# Altium schematic sheet DAC.SchDoc
size A
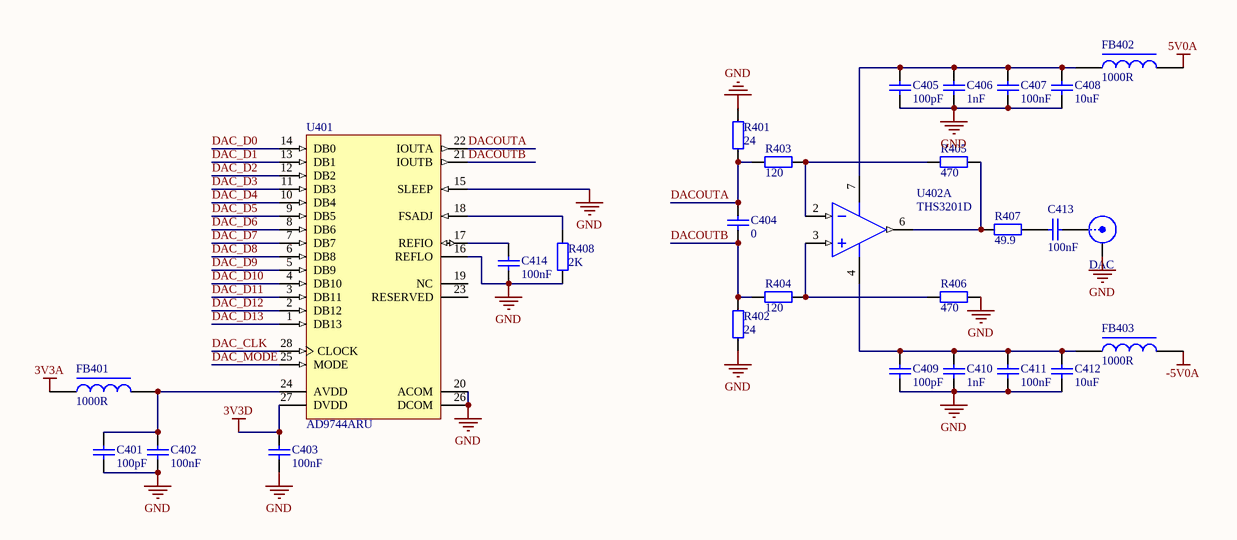
[diagram p0: DAC.SchDoc]

## Parts
C401  value 100pF  [0402C]  (hidden comment: MLCC)
C402  value 100nF  [0402C]  (hidden comment: MLCC)
C403  value 100nF  [0402C]  (hidden comment: MLCC)
C404  value 0  [0603C]  (hidden comment: MLCC)
C405  value 100pF  [0402C]  (hidden comment: MLCC)
C406  value 1nF  [0402C]  (hidden comment: MLCC)
C407  value 100nF  [0603C]  (hidden comment: MLCC)
C408  value 10uF  [0805C]  (hidden comment: MLCC)
C409  value 100pF  [0402C]  (hidden comment: MLCC)
C410  value 1nF  [0402C]  (hidden comment: MLCC)
C411  value 100nF  [0603C]  (hidden comment: MLCC)
C412  value 10uF  [0805C]  (hidden comment: MLCC)
C413  value 100nF  [0603C]  (hidden comment: MLCC)
C414  value 100nF  [0402C]  (hidden comment: MLCC)
DAC  SMA  [SMA-V]  (value not drawn)
FB401  value 1000R  [0603L]  (hidden comment: FerriteBead)
FB402  value 1000R  [0603L]  (hidden comment: FerriteBead)
FB403  value 1000R  [0603L]  (hidden comment: FerriteBead)
R401  value 24  [0603R]  (hidden comment: Resistor)
R402  value 24  [0603R]  (hidden comment: Resistor)
R403  value 120  [0603R]  (hidden comment: Resistor)
R404  value 120  [0603R]  (hidden comment: Resistor)
R405  value 470  [0603R]  (hidden comment: Resistor)
R406  value 470  [0603R]  (hidden comment: Resistor)
R407  value 49.9  [0603R]  (hidden comment: Resistor)
R408  value 2K  [0603R]  (hidden comment: Resistor)
U401  AD9744ARU  [RU-28_N]
U402  THS3201D  [D0008A_N]  (part A of 2)

## Nets
3V3A: FB401.1
3V3D: C403.2 U401.27(DVDD)
5V0A: FB402.2
-5V0A: FB403.2
GND: C401.1 C402.1 C403.1 C405.1 C406.1 C407.1 C408.1 C409.1 C410.1 C411.1 C412.1 C414.1 DAC.2(Y) R401.2 R402.1 R406.2 R408.1 U401.15(SLEEP) U401.16(REFLO) U401.20(ACOM) U401.26(DCOM)
DAC_CLK: U401.28(CLOCK)
DAC_D0: U401.14(DB0)
DAC_D1: U401.13(DB1)
DAC_D2: U401.12(DB2)
DAC_D3: U401.11(DB3)
DAC_D4: U401.10(DB4)
DAC_D5: U401.9(DB5)
DAC_D6: U401.8(DB6)
DAC_D7: U401.7(DB7)
DAC_D8: U401.6(DB8)
DAC_D9: U401.5(DB9)
DAC_D10: U401.4(DB10)
DAC_D11: U401.3(DB11)
DAC_D12: U401.2(DB12)
DAC_D13: U401.1(DB13)
DAC_MODE: U401.25(MODE)
DACOUTA: C404.2 R401.1 R403.1 U401.22(IOUTA)
DACOUTB: C404.1 R402.2 R404.1 U401.21(IOUTB)
NetC401_2: C401.2 C402.2 FB401.2 U401.24(AVDD)
NetC405_2: C405.2 C406.2 C407.2 C408.2 FB402.1 U402.7(VS+)
NetC409_2: C409.2 C410.2 C411.2 C412.2 FB403.1 U402.4(VS-)
NetC413_1: C413.1 R407.2
NetC413_2: C413.2 DAC.1(X)
NetC414_2: C414.2 U401.17(REFIO)
NetR403_2: R403.2 R405.1 U402.2(VIN-)
NetR404_2: R404.2 R406.1 U402.3(VIN+)
NetR405_2: R405.2 R407.1 U402.6(VOUT)
NetR408_2: R408.2 U401.18(FSADJ)

Not connected (* = marked no-connect by the designer): U401 19(NC) 23(RESERVED)

## Library data of the parts
DAC = SMA: SMA Connector
U401 = AD9744ARU: Single 14-Bit TxDAC, 210 Msps, -40 to +85 degC, RU-28, Tube; Generic Part Number: AD9744; Manufacturer: Analog Devices; # DAC Outputs: 1; Max V+: 3.6V; Op Pwr Diss: 145mW; Resolution (Bits): 14; Settling Time: 11ns; Single Supply: Yes; DatasheetVersion: Rev.B; PackageVersion: 2005; PackageReference: RU-28; PackageDescription: 28-Lead Thin Shrink Small Outline Package [TSSOP]; Supplier 1: Digi-Key; Supplier Part Number 1: AD9744ARU-ND; Supplier 2: Mouser; Supplier Part Number 2: 584-AD9744ARU; Packing: Tube; RoHS: N; Mounting Technology: Surface Mount; Code_JEDEC: MO-153-AE; PartNumber: AD9744ARU; ComponentLink1Description: Manufacturer URL; ComponentLink1URL: http://www.analog.com/en/index.html; ComponentLink2Description: Datasheet; ComponentLink2URL: http://www.analog.com/static/imported-files/data_sheets/AD9744.pdf; ComponentLink3Description: Package Specification; ComponentLink3URL: http://www.analog.com/static/imported-files/packages/249854663RU_28.pdf; ComponentLink4Description: Product URL; ComponentLink4URL: http://www.analog.com/en/digital-to-analog-converters/da-converters/ad9744/products/product.html
U402 = CMP-0018-00113-2: 1.8 GHz Current Feedback Amplifier, 6.6 to 15 V, -40 to 85 degC, 8-pin SOIC (D8), Green (RoHS & no Sb/Br); Manufacturer: Texas Instruments; Sub Family: High Output Current Amplifier (>=50mA), High Speed Amplifier (>=50MHz); Number of Channels: 1; Diff Phase(deg): 0.007; 2nd Harmonic(dBc): 64; Vs(Max)(V): 15; @ MHz: 10; Io(Typ)(mA): 115; Vn at Flatband(Typ)(nV/rtHz): 1.65; Iib(Max)(nA): 50000; BW @ Acl(MHz): 1800; Diff Gain(%): 0.008; Vs(Min)(V): 6.6; Slew Rate(Typ)(V/us): 6700; Vio(Max)(mV): 4; THD (Fc is 1 MHz)(Typ)(dB): -90; Settling Time (0.1%)(Typ)(ns): 20; Iq per channel(Max)(mA): 21; 3rd Harmonic(dBc): 73; PartNumber: THS3201D; PackageVersion: 4040047-3/M, 06/2011; Code_JEDEC: MS-012; Mounting Technology: Surface Mount; DatasheetVersion: SLOS416C; Acl, min stable gain(V/V): 1; ComponentLink2URL: http://www.ti.com/general/docs/lit/getliterature.tsp?genericPartNumber=THS3201&fileType=pdf; ComponentLink1URL: http://www.ti.com/; ComponentLink1Description: Manufacturer URL; PackageDescription: 8-Pin Plastic Small Outline, Body 4.9 x 3.9 mm, Pitch 1.27 mm; ComponentLink2Description: Datasheet; ComponentLink3Description: Package Specification; Eco-Plan: Green (RoHS & no Sb/Br); PackageReference: D0008A; ComponentLink3URL: http://www.ti.com/litv/pdf/msoi002j; PartId: 1